# EAGLE design tick-pi-mk-1.1 (EAGLE 7.5.0)
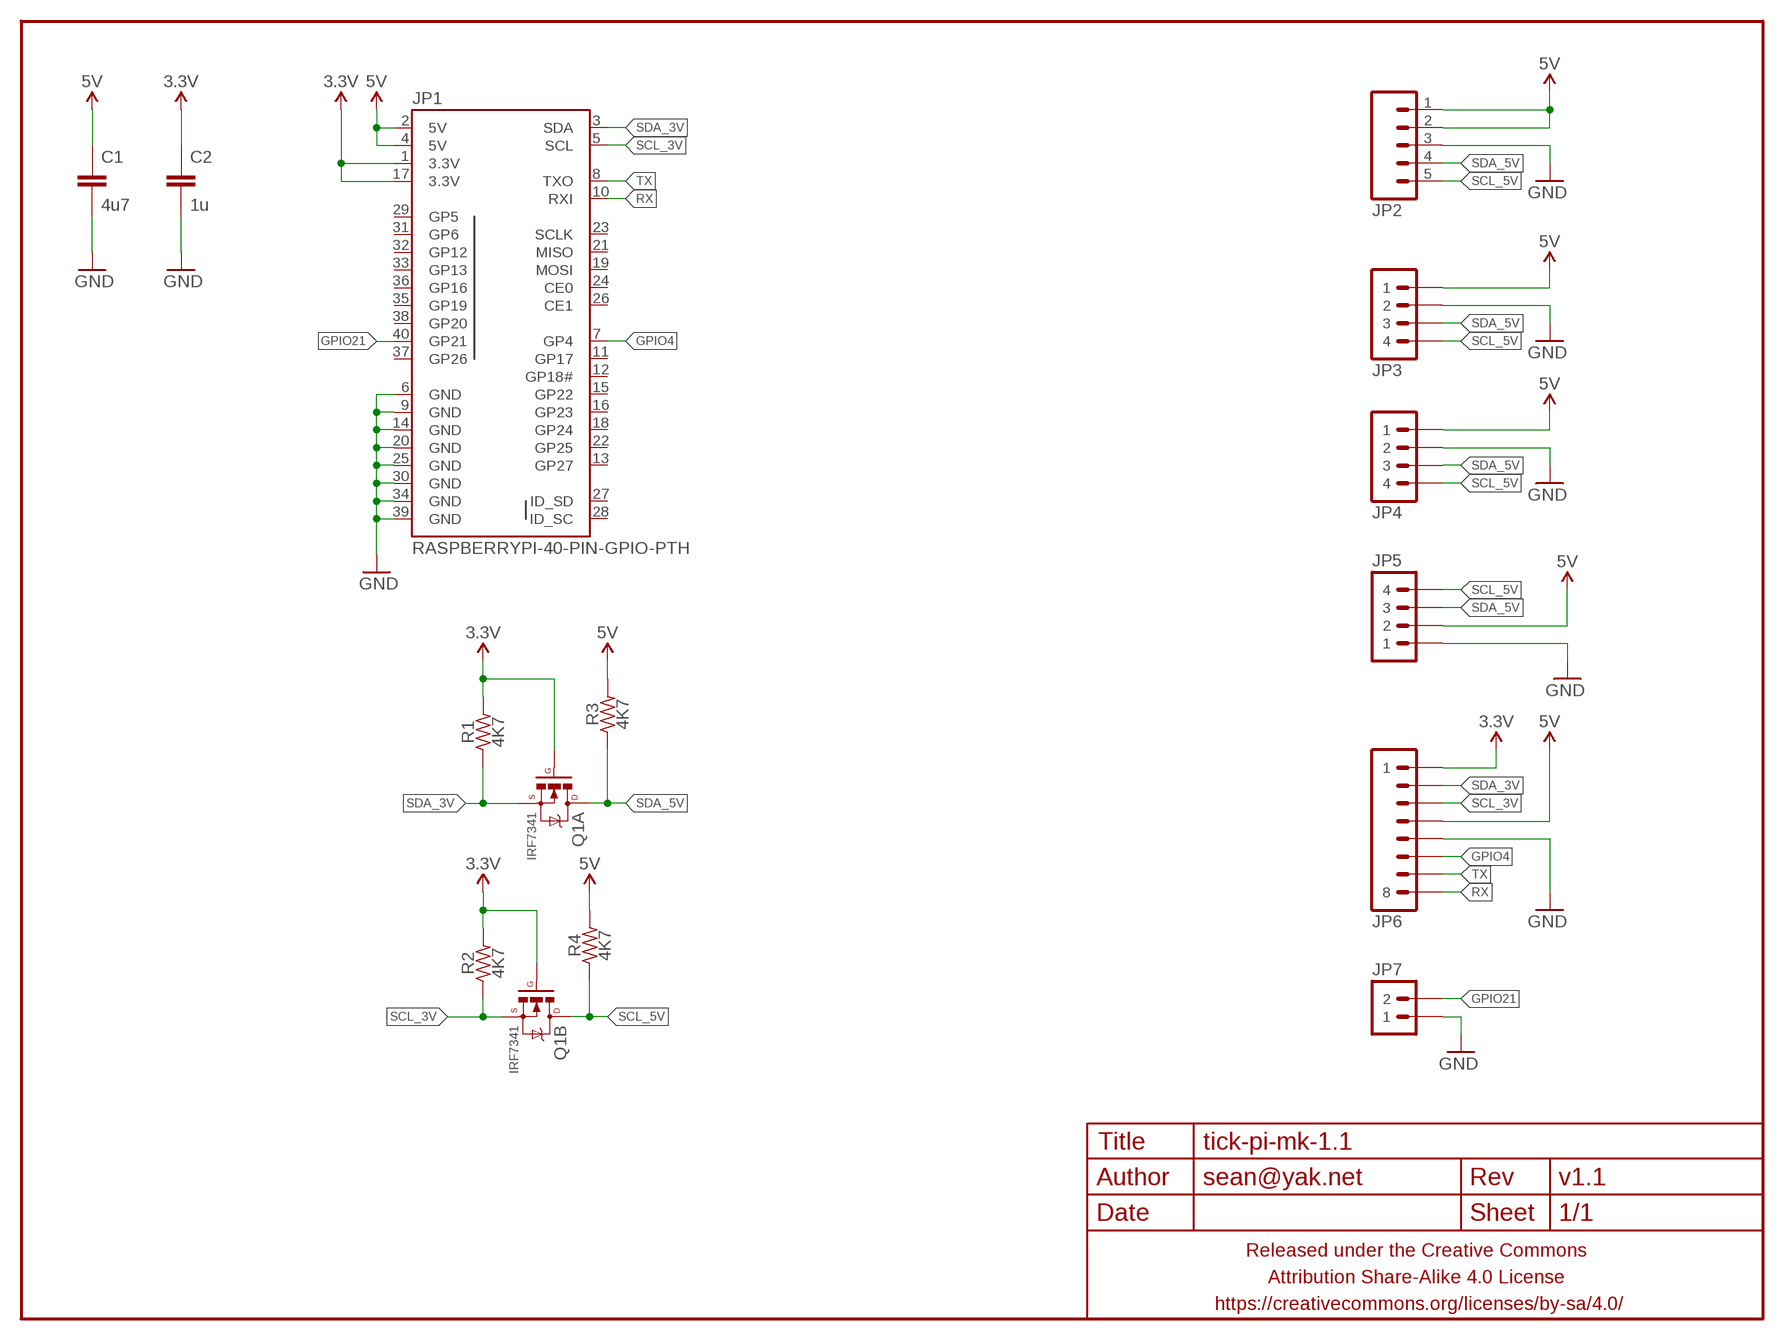
[diagram p0: schematic, sheet 1]

## Parts
C1  4u7  CAPACITOR-CERAMICC0805-TIGHTER  [C0805-TIGHTER]
C2  1u  CAPACITOR-CERAMICC0603-TIGHTER  [C0603-TIGHTER]
FRAME1  FRAME-LETTERNO_PACKAGE  [DUMMY]
JP1  RASPBERRYPI-40-PIN-GPIO-PTH  [2X20_PTH]
JP2  M05PTH-CENTERED-RA-FEMALE  [1X05_PTH_CENTERED_RA_FEMALE]
JP3  M04PTH  [1X04-PTH-VERT]
JP4  M04PTH  [1X04-PTH-VERT]
JP5  M04PTH  [1X04-PTH-VERT]
JP6  M081X08  [1X08]
JP7  M02PTH-CENTERED  [1X02-CENTER]
Q1  IRF7341  MOSFET-NCHANNEL-DUALSOIC8  [SO08]
R1  4K7  RESISTORR0603  [R0603]
R2  4K7  RESISTORR0603  [R0603]
R3  4K7  RESISTORR0603  [R0603]
R4  4K7  RESISTORR0603  [R0603]

## Nets
3.3V: C2.1 JP1.1(3.3V) JP1.17(3.3V) JP6.1 Q1.2(A:G) Q1.4(B:G) R1.2 R2.2
5V: C1.1 JP1.2(5V) JP1.4(5V) JP2.1 JP2.2 JP3.1 JP4.1 JP5.2 JP6.4 R3.2 R4.2
GND: C1.2 C2.2 JP1.6(GND) JP1.9(GND) JP1.14(GND) JP1.20(GND) JP1.25(GND) JP1.30(GND) JP1.34(GND) JP1.39(GND) JP2.3 JP3.2 JP4.2 JP5.1 JP6.5 JP7.1
GPIO4: JP1.7(GP4) JP6.6
GPIO21: JP1.40(GP21) JP7.2
RX: JP1.10(RXI) JP6.8
SCL_3V: JP1.5(SCL) JP6.3 Q1.3(B:S) R2.1
SCL_5V: JP2.5 JP3.4 JP4.4 JP5.4 Q1.5(B:D) Q1.6(B:D) R4.1
SDA_3V: JP1.3(SDA) JP6.2 Q1.1(A:S) R1.1
SDA_5V: JP2.4 JP3.3 JP4.3 JP5.3 Q1.7(A:D) Q1.8(A:D) R3.1
TX: JP1.8(TXO) JP6.7
Unconnected: JP1.11(GP17) JP1.12(GP18#) JP1.13(GP27) JP1.15(GP22) JP1.16(GP23) JP1.18(GP24) JP1.19(MOSI) JP1.21(MISO) JP1.22(GP25) JP1.23(SCLK) JP1.24(CE0) JP1.26(CE1) JP1.27(ID_SD) JP1.28(ID_SC) JP1.29(GP5) JP1.31(GP6) JP1.32(GP12) JP1.33(GP13) JP1.35(GP19) JP1.36(GP16) JP1.37(GP26) JP1.38(GP20)

## Library data of the parts
C1 C2 = a_parts:CAPACITOR-CERAMIC: CAPACITOR, European symbol
FRAME1 = a_parts:FRAME-LETTER: Schematic Frame Standard 8.5x11 US Letter frame; DESIGNER: sean@yak.net; VERSION: v1.1
JP1 = a_parts:RASPBERRYPI-40-PIN-GPIO: Second Generation Raspberry Pi GPIO Header 2x20 pin connector, as found on B, B+, A+ models.
JP2 = a_parts:M05: Header 5 Standard 5-pin 0.1" header. Use with straight break away headers (SKU : PRT-00116), right angle break away headers (PRT-00553), swiss pins (PRT-00743), machine pins (PRT-00117), and female headers (PRT-00115). Molex polarized connector foot print use with SKU : PRT-08230 with associated crimp pins and housings.
JP3-JP5 = a_parts:M04: Header 4 Standard 4-pin 0.1" header. Use with straight break away headers (SKU : PRT-00116), right angle break away headers (PRT-00553), swiss pins (PRT-00743), machine pins (PRT-00117), and female headers (PRT-00115). Molex polarized connector foot print use with SKU : PRT-08231 with associated crimp pins and housings. 1MM SMD Version SKU: PRT-10208
JP6 = a_parts:M08: Header 8 Standard 8-pin 0.1" header. Use with straight break away headers (SKU : PRT-00116), right angle break away headers (PRT-00553), swiss pins (PRT-00743), machine pins (PRT-00117), and female headers (PRT-00115).
JP7 = a_parts:M02: Standard 2-pin 0.1" header. Use with - straight break away headers ( PRT-00116) - right angle break away headers (PRT-00553) - swiss pins (PRT-00743) - machine pins (PRT-00117) - female headers (PRT-00115) Molex polarized connector foot print use with: PRT-08233 with associated crimp pins and housings. 2.54_SCREWTERM for use with PRT-10571. 3.5mm Screw Terminal footprints for PRT-08084 5mm Screw Terminal footprints for use with PRT-08433
Q1 = a_parts:MOSFET-NCHANNEL-DUAL: 2N7002DW-7-F Newark 66W0958 Digi-Key 2N7002DW-FDICT-ND
R1-R4 = a_parts:RESISTOR: RESISTOR, American symbol

## Board
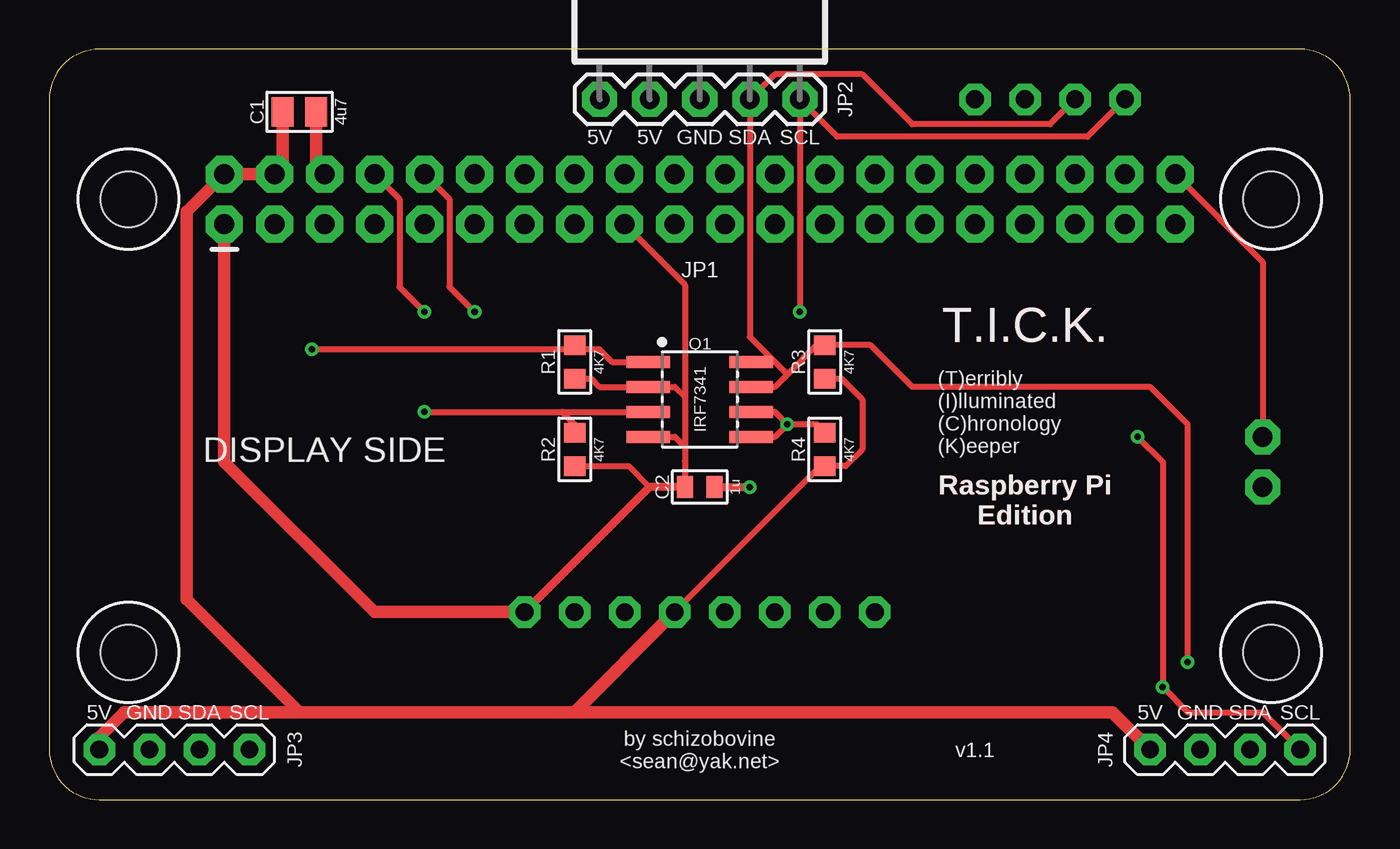
[diagram p1: board, top side]
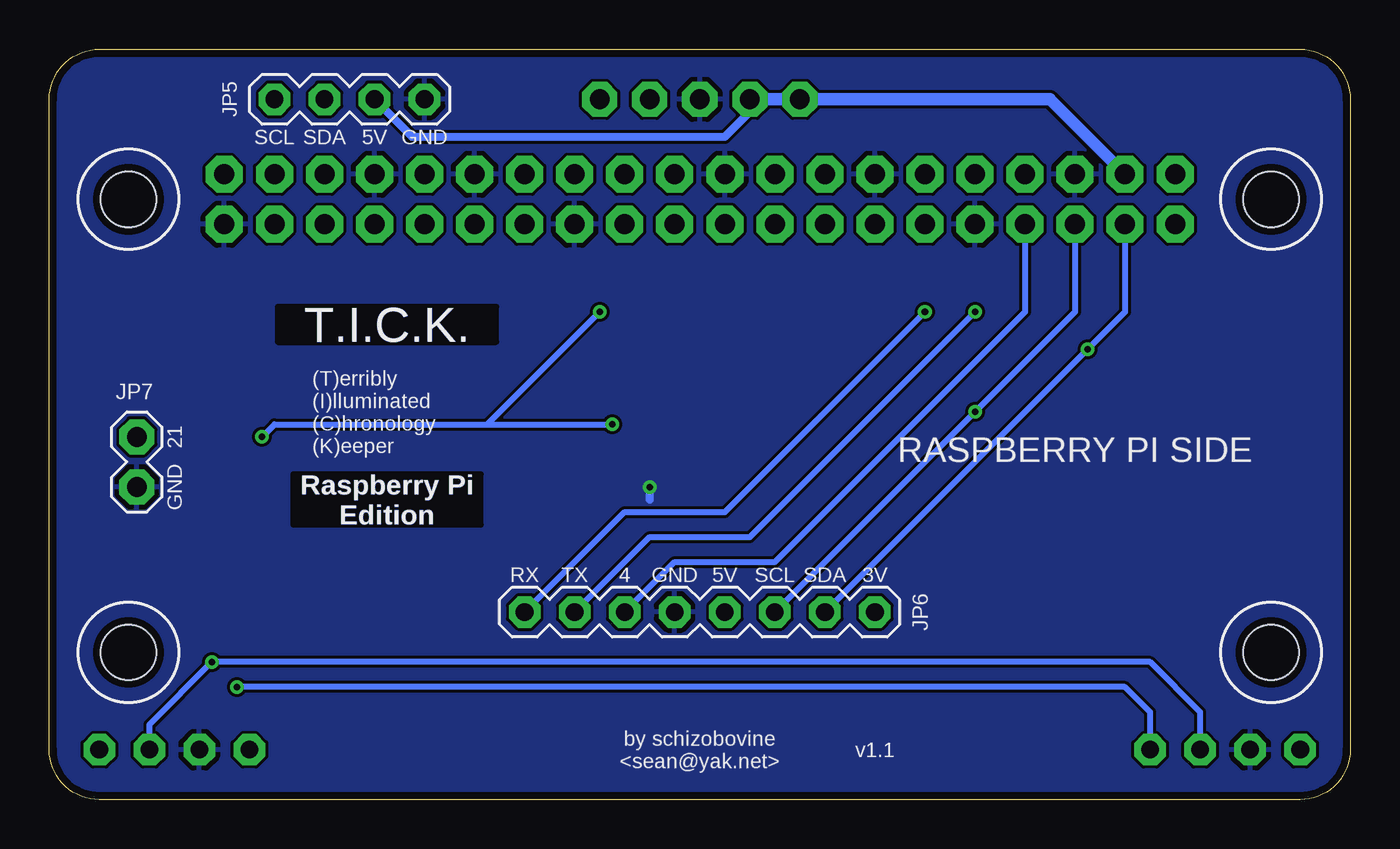
[diagram p2: board, bottom side, seen from below]

Size 66.04 x 38.1 mm. Coordinates in mm from the lower left corner, seen from the top.
Outline: 66.04,2.54 66.04,35.56 arc90 63.5,38.1 2.54,38.1 arc90 0,35.56 0,2.54 arc90 2.54,0 63.5,0 arc90 66.04,2.54
Copper layers (1*16): Top 0.0356mm / dielectric 1.5011mm / Bottom 0.0356mm
Design rules "LaenPCBOrder2": minimum track width 6mil, minimum drill 13mil, track to track 6mil, track to pad 6mil, pad to pad 6mil, via to via 6mil, smd to smd 6mil, copper to edge 15mil, drill to drill 6mil, minimum pad ring 7mil, minimum via ring 7mil, stop-mask expansion 3mil, vias tented up to drill 20mil, thermal gap 10mil
Holes 2.8 mm at 4.02,30.48 62.02,30.48 4.02,7.48 62.02,7.48

### Footprints (pad centres in the part's own frame; a part is rotated, then mirrored left to right if it is on the bottom)
C0805-TIGHTER = smd 1.1 x 1.5: 1 -0.85,0; 2 0.85,0
C0603-TIGHTER = smd 0.8 x 1.1: 1 -0.75,0; 2 0.75,0
2X20_PTH = drill 1.016 pad 1.88 octagon: 1 -24.13,-1.27; 2 -24.13,1.27; 3 -21.59,-1.27; 4 -21.59,1.27; 5 -19.05,-1.27; 6 -19.05,1.27; 7 -16.51,-1.27; 8 -16.51,1.27; 9 -13.97,-1.27; 10 -13.97,1.27; 11 -11.43,-1.27; 12 -11.43,1.27; 13 -8.89,-1.27; 14 -8.89,1.27; 15 -6.35,-1.27; 16 -6.35,1.27; 17 -3.81,-1.27; 18 -3.81,1.27; 19 -1.27,-1.27; 20 -1.27,1.27; 21 1.27,-1.27; 22 1.27,1.27; 23 3.81,-1.27; 24 3.81,1.27; 25 6.35,-1.27; 26 6.35,1.27; 27 8.89,-1.27; 28 8.89,1.27; 29 11.43,-1.27; 30 11.43,1.27; 31 13.97,-1.27; 32 13.97,1.27; 33 16.51,-1.27; 34 16.51,1.27; 35 19.05,-1.27; 36 19.05,1.27; 37 21.59,-1.27; 38 21.59,1.27; 39 24.13,-1.27; 40 24.13,1.27
1X05_PTH_CENTERED_RA_FEMALE = drill 1 pad 1.778 octagon: 1 -5.08,0; 2 -2.54,0; 3 0,0; 4 2.54,0; 5 5.08,0
1X04-PTH-VERT = drill 0.9 pad 1.6 octagon: 1 0,0; 2 2.54,0; 3 5.08,0; 4 7.62,0
1X08 = drill 0.9 pad 1.6 octagon: 1 0,0; 2 2.54,0; 3 5.08,0; 4 7.62,0; 5 10.16,0; 6 12.7,0; 7 15.24,0; 8 17.78,0
1X02-CENTER = drill 1 pad 1.778 octagon: 1 -1.27,0; 2 1.27,0
SO08 = smd 0.61 x 2.21: 1 -1.905,-2.616; 2 -0.635,-2.616; 3 0.635,-2.616; 4 1.905,-2.616; 5 1.905,2.616; 6 0.635,2.616; 7 -0.635,2.616; 8 -1.905,2.616
R0603 = smd 1 x 1.1: 1 -0.85,0; 2 0.85,0

### Placement (x,y rotation side)
C1  12.7,34.92 0 top
C2  33.02,15.88 0 top
FRAME1  0,0 0 top
JP1  33.02,30.48 0 top
JP2  33.02,35.56 0 top
JP3  2.54,2.54 0 top
JP4  55.88,2.54 0 top
JP5  46.99,35.56 180 bottom
JP6  24.13,9.53 180 bottom
JP7  61.59,17.14 90 bottom
Q1  33.02,20.32 270 top
R1  26.67,22.23 270 top
R2  26.67,17.78 270 top
R3  39.37,22.23 270 top
R4  39.37,17.78 270 top

### Tracks (layer width: path | path; a pad name or v marks a point on that pad's centre or on a via)
3.3V
  Top 0.305: R2.2 29.43,16.93 30.48,15.88 | 32.27,20.43 31.75,20.95 Q1.2 27.94,20.95 27.52,21.38 R1.2 | 32.27,20.43 32.27,17.91 | 32.27,17.91 C2.1 32.27,17.18 | JP1.17 32.27,26.15 32.27,20.43 | Q1.4 31.76,18.41 32.27,17.91
  Top 0.406: C2.1 30.48,15.88 JP6.1
  Top 0.635: JP1.1 8.89,17.14 16.51,9.53 JP6.1
5V
  Top 0.305: JP6.4 39.16,16.93 R4.2 40.42,16.93 41.27,17.78 41.27,20.32 40.22,21.38 R3.2
  Top 0.635: JP3.1 2.54,3.17 3.81,4.45 12.7,4.45 | 12.7,4.45 26.67,4.45 | 26.67,4.45 JP6.4 | JP4.1 53.98,4.45 26.67,4.45 | 12.7,4.45 6.99,10.16 6.99,29.84 JP1.2 JP1.4 11.85,32.17 C1.1
  Bottom 0.406: JP5.2 47.62,33.66 31.75,33.66 30.48,34.92 JP2.2
  Bottom 0.635: JP1.4 15.24,35.56 JP2.1 JP2.2
GND  (via drill 0.33)
  Top 0.406: C2.2 v35.56,15.88
  Top 0.635: JP1.6 13.55,32.17 C1.2
  Bottom 0.406: v35.56,15.88 35.56,15.24
  pour Bottom: 2.54,38.1 63.5,38.1 arc-90 66.04,35.56 66.04,2.54 arc-90 63.5,0 2.54,0 arc-90 0,2.54 0,35.56 arc-90
GPIO4
  Bottom 0.305: JP6.6 34.29,12.06 29.21,12.06 16.51,24.77 JP1.7
GPIO21
  Top 0.305: JP1.40 61.59,27.3 JP7.2
RX  (via drill 0.33)
  Top 0.305: JP1.10 20.32,30.48 20.32,26.04 v21.59,24.77
  Bottom 0.305: JP6.8 36.83,14.61 31.75,14.61 v21.59,24.77
SCL_3V  (via drill 0.33)
  Top 0.305: v19.05,19.68 26.04,19.68 | 26.04,19.68 Q1.3 | R2.1 26.67,19.05 26.04,19.68
  Bottom 0.305: JP6.3 v19.05,19.68 13.97,24.77 JP1.5
SCL_5V  (via drill 0.33)
  Top 0.305: JP4.4 61.59,4.45 57.78,4.45 v56.52,5.71 56.52,17.14 v55.24,18.41 | v38.1,24.77 JP2.5 40.01,33.66 52.7,33.66 JP5.4 | Q1.5 36.83,18.41 v37.47,19.05 | Q1.6 36.83,19.68 v37.47,19.05 | R4.1 38.95,19.05 v37.47,19.05
  Bottom 0.305: JP3.4 10.16,4.45 11.43,5.71 v56.52,5.71 | v55.24,18.41 54.61,19.05 43.81,19.05 | 43.81,19.05 v37.47,19.05 | v38.1,24.77 43.81,19.05
SDA_3V  (via drill 0.33)
  Top 0.305: Q1.1 28.57,22.23 27.94,22.86 26.67,22.86 | 26.67,22.86 v13.34,22.86 | R1.1 26.67,22.86
  Bottom 0.305: JP6.2 v13.34,22.86 11.43,24.77 JP1.3
SDA_5V  (via drill 0.33)
  Top 0.305: JP5.3 50.8,34.29 43.81,34.29 41.27,36.83 36.83,36.83 JP2.4 35.56,23.5 36.83,22.23 | Q1.7 36.83,20.95 37.47,21.59 | Q1.8 36.83,22.23 | 36.83,22.23 37.47,21.59 | v57.78,6.99 57.78,19.05 55.88,20.95 43.81,20.95 41.7,23.07 R3.1 38.95,23.07 37.47,21.59
  Bottom 0.305: JP3.3 7.62,4.45 10.16,6.99 v57.78,6.99 60.96,3.81 JP4.3
TX  (via drill 0.33)
  Top 0.305: JP1.8 17.78,30.48 17.78,26.04 v19.05,24.77
  Bottom 0.305: JP6.7 35.56,13.34 30.48,13.34 v19.05,24.77

### Text on the board
Top: T.I.C.K. | Raspberry Pi / Edition
Bottom: T.I.C.K. | Raspberry Pi / Edition
tPlace: 5V | 5V | GND | SDA | SCL | T.I.C.K. | (T)erribly / (I)lluminated / (C)hronology / (K)eeper | DISPLAY SIDE | Raspberry Pi / Edition | 5V | GND | SDA | SCL | 5V | GND | SDA | SCL | by schizobovine / <sean@yak.net>
bPlace: GND | 5V | SDA | SCL | T.I.C.K. | (T)erribly / (I)lluminated / (C)hronology / (K)eeper | RASPBERRY PI SIDE | 21 | GND | Raspberry Pi / Edition | 3V | SDA | SCL | 5V | GND | 4 | TX | RX | by schizobovine / <sean@yak.net>